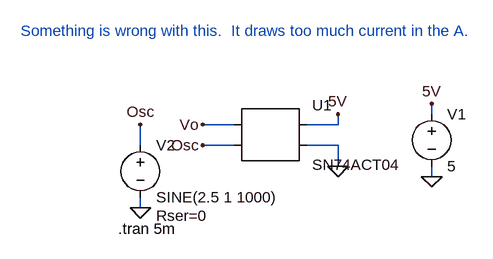
[diagram p0: schematic Inverter.asc]
Inverter.asc, the LTspice schematic file:
Version 4
SHEET 1 880 680
WIRE 384 96 384 80
WIRE 80 112 32 112
WIRE 240 112 240 96
WIRE 240 112 192 112
WIRE -64 144 -64 112
WIRE 80 144 32 144
WIRE 240 144 192 144
WIRE 240 176 240 144
WIRE 384 192 384 176
WIRE -64 240 -64 224
FLAG 240 176 0
FLAG -64 240 0
FLAG -64 112 Osc
FLAG 32 144 Osc
FLAG 384 80 5V
FLAG 240 96 5V
FLAG 384 192 0
FLAG 32 112 Vo
SYMBOL AutoGenerated\\SN74ACT04 128 128 R0
SYMATTR InstName U1
SYMBOL voltage 384 80 R0
WINDOW 123 0 0 Left 0
WINDOW 39 0 0 Left 0
SYMATTR InstName V1
SYMATTR Value 5
SYMBOL voltage -64 128 R0
WINDOW 123 0 0 Left 0
WINDOW 39 24 124 Left 2
SYMATTR InstName V2
SYMATTR Value SINE(2.5 1 1000)
SYMATTR SpiceLine Rser=0
TEXT -98 272 Left 2 !.tran 5m
TEXT -248 -32 Left 2 ;Something is wrong with this.  It draws too much current in the A.

The netlist it stands for:
* Inverter.asc
* U1: SN74ACT04 (symbol AutoGenerated\SN74ACT04 not available, pins judged from their places): pin1=Vo pin2=Osc pin3=5V pin4=0
V1 5V 0 5
V2 Osc 0 SINE(2.5 1 1000) Rser=0
.tran 5m
* Something is wrong with this.  It draws too much current in the A.
.backanno
.end